# Altium schematic sheet filter_diff_shunt.SchDoc
size A
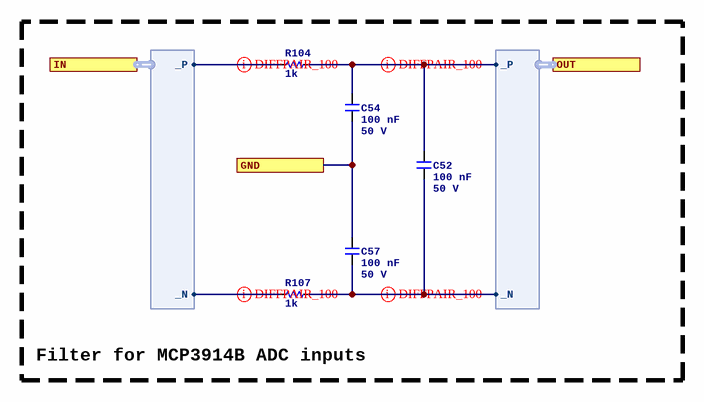
[diagram p0: filter_diff_shunt.SchDoc]

## Parts
C52  Capacitance: 100 nF  Voltage Rating: 50 V  [C0402]  (hidden comment: CL05B104KB54PNC)
C54  Capacitance: 100 nF  Voltage Rating: 50 V  [C0402]  (hidden comment: CL05B104KB54PNC)
C57  Capacitance: 100 nF  Voltage Rating: 50 V  [C0402]  (hidden comment: CL05B104KB54PNC)
R104  value 1k  [R0402]  (hidden comment: 0402WGF1001TCE)
R107  value 1k  [R0402]  (hidden comment: 0402WGF1001TCE)

## Blocks framed on the sheet
Filter for MCP3914B ADC inputs: C52 C54 C57 R104 R107

## Ports
GND, IN (harness DIFF), OUT (harness DIFF)

## Harnesses
DIFF: _N, _P

## Nets
GND: C54.2 C57.1 ; port GND
NetC52_1: C52.1 C54.1 R104.1 ; port OUT._P
NetC52_2: C52.2 C57.2 R107.1 ; port OUT._N
NetR104_2: R104.2 ; port IN._P
NetR107_2: R107.2 ; port IN._N

## Layout directives
differential pair; differential pair class DE_100: NetC52_1, NetC52_2, NetR104_2, NetR107_2

## Library data of the parts
C52 C54 C57 = CL05B104KB54PNC: Manufacturer: Samsung Electro-Mechanics; Dielectric: X7R; ComponentLink1URL: https://wmsc.lcsc.com/wmsc/upload/file/pdf/v2/lcsc/2304140030_Samsung-Electro-Mechanics-CL05B104KB54PNC_C307331.pdf; ComponentLink1Description: Datasheet; Manufacturer Part Number: CL05B104KB54PNC; Package: 0402; Supplier 2: LCSC; Supplier Part Number 2: C307331
R104 R107 = 0402WGF1001TCE: Manufacturer: UNI-ROYAL(Uniroyal Elec); Tolerance: 1%; Temperature Coefficient: ±100ppm/?; Power Rating (mW): 62.5; ComponentLink1Description: Datasheet; ComponentLink1URL: https://wmsc.lcsc.com/wmsc/upload/file/pdf/v2/lcsc/2206010216_UNI-ROYAL-Uniroyal-Elec-0402WGF1001TCE_C11702.pdf; Manufacturer Part Number: 0402WGF1001TCE; Package: 0402; Supplier 2: LCSC; Supplier Part Number 2: C11702